# EAGLE design Metro THM+LDO Rev B (EAGLE 6.6.0)
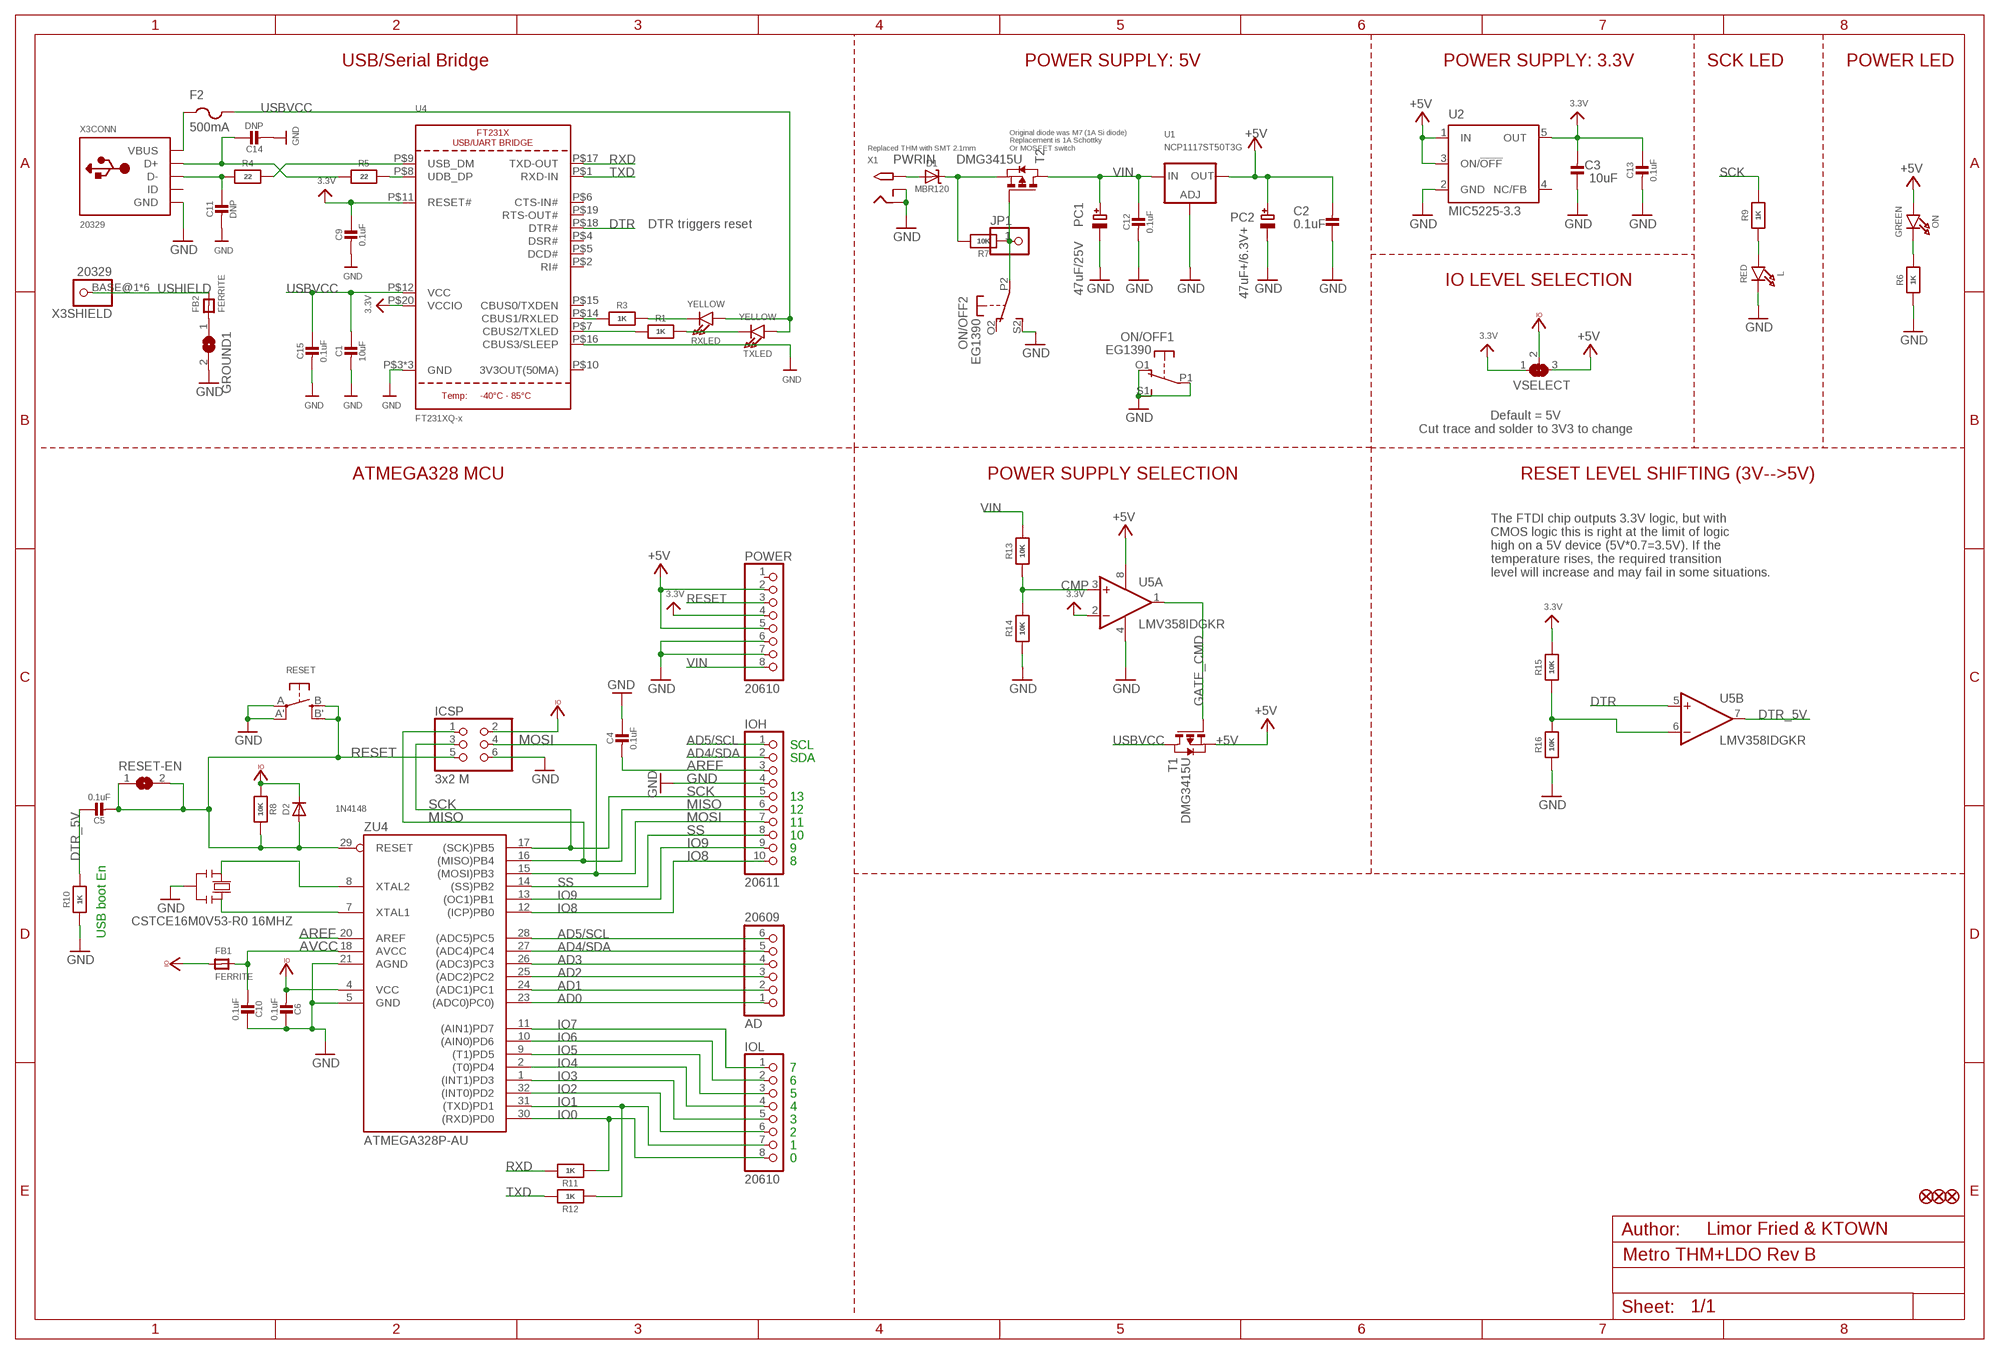
[diagram p0: schematic, sheet 1]

## Parts
AD  20609  HEADER-1X6  [1X06_OVAL]
C1  10uF  CAP_CERAMIC0805-NOOUTLINE  [0805-NO]
C2  0.1uF  CAP_CERAMIC0805-NOOUTLINE  [0805-NO]
C3  10uF  CAP_CERAMIC0805-NOOUTLINE  [0805-NO]
C4  0.1uF  CAP_CERAMIC0805-NOOUTLINE  [0805-NO]
C5  0.1uF  CAP_CERAMIC0805-NOOUTLINE  [0805-NO]
C6  0.1uF  CAP_CERAMIC0805-NOOUTLINE  [0805-NO]
C9  0.1uF  CAP_CERAMIC0805-NOOUTLINE  [0805-NO]
C10  0.1uF  CAP_CERAMIC0805_10MGAP  [0805_10MGAP]
C11  DNP  CAP_CERAMIC0805-NOOUTLINE  [0805-NO]
C12  0.1uF  CAP_CERAMIC0805-NOOUTLINE  [0805-NO]
C13  0.1uF  CAP_CERAMIC0805-NOOUTLINE  [0805-NO]
C14  DNP  CAP_CERAMIC0805-NOOUTLINE  [0805-NO]
C15  0.1uF  CAP_CERAMIC0805-NOOUTLINE  [0805-NO]
D1  MBR120  DIODE-SCHOTTKYSOD-123  [SOD-123]
D2  1N4148  DIODESOD-323  [SOD-323]
F2  500mA  PTCFUSE-1206  [R1206]
FB1  FERRITE  FERRITE-0805NO  [0805-NO]
FB2  FERRITE  FERRITE-0805NO  [0805-NO]
FD1  FIDUCIAL""  [FIDUCIAL_1MM]
FD2  FIDUCIAL""  [FIDUCIAL_1MM]
FD3  FIDUCIAL""  [FIDUCIAL_1MM]
GROUND1  SJ  [SJ]
ICSP  3x2 M  HEADER-2X3  [2X03_ROUND_70MIL]
IOH  20611  HEADER-1X10  [1X10_OVAL]
IOL  20610  HEADER-1X8  [1X08_OVAL]
JP1  HEADER-1X1ROUND  [1X01_ROUND]
L  RED  LED0805_NOOUTLINE  [CHIPLED_0805_NOOUTLINE]
ON  GREEN  LED0805_NOOUTLINE  [CHIPLED_0805_NOOUTLINE]
ON/OFF  EG1390  DPDT-EG1390  [EG1390]
PC1  47uF/25V  CAP_ELECTROLYTICPANASONIC_D  [PANASONIC_D]
PC2  47uF+/6.3V+  CAP_ELECTROLYTICPANASONIC_D  [PANASONIC_D]
POWER  20610  HEADER-1X8  [1X08_OVAL]
R1  1K  RESISTOR0805_NOOUTLINE  [0805-NO]
R3  1K  RESISTOR0805_NOOUTLINE  [0805-NO]
R4  22  RESISTOR0805_NOOUTLINE  [0805-NO]
R5  22  RESISTOR0805_NOOUTLINE  [0805-NO]
R6  1K  RESISTOR0805_NOOUTLINE  [0805-NO]
R7  10K  RESISTOR0805_NOOUTLINE  [0805-NO]
R8  10K  RESISTOR_0805MP  [_0805MP]
R9  1K  RESISTOR0805_NOOUTLINE  [0805-NO]
R10  1K  RESISTOR0805_NOOUTLINE  [0805-NO]
R11  1K  RESISTOR0805_NOOUTLINE  [0805-NO]
R12  1K  RESISTOR0805_NOOUTLINE  [0805-NO]
R13  10K  RESISTOR0805_NOOUTLINE  [0805-NO]
R14  10K  RESISTOR0805_NOOUTLINE  [0805-NO]
R15  10K  RESISTOR0805_NOOUTLINE  [0805-NO]
R16  10K  RESISTOR0805_NOOUTLINE  [0805-NO]
RESET  SWITCH_TACT_SMT  [EVQ-Q2]
RESET-EN  SJ  [SJ]
RXLED  YELLOW  LED0805_NOOUTLINE  [CHIPLED_0805_NOOUTLINE]
T1  DMG3415U  PMOSSOT23  [SOT-23]
T2  DMG3415U  PMOSSOT23  [SOT-23]
TXLED  YELLOW  LED0805_NOOUTLINE  [CHIPLED_0805_NOOUTLINE]
U1  NCP1117ST50T3G  LM1117SOT223-REFLOW  [SOT223-R]
U2  MIC5225-3.3  LP2985-XXDBVR33  [SOT23-DBV]
U4  FT231XQ-x  FT231X  [QFN20_4MM]
U5  LMV358IDGKR  LMV358MMX  [MSOP08]
VSELECT  SOLDERJUMPER_2WAY  [SOLDERJUMPER_2WAY_OPEN_NOPASTE]
X1  2.1MMJACKSMT  [DCJACK_2MM_SMT]
X3  20329  USB_W_SHIELD_20329  [4UCONN_20329]
Y2  CSTCE16M0V53-R0 16MHZ  RESONATORMU  [RESONATOR]
ZU4  ATMEGA328P-AU  [TQFP32-08]

## Nets
3.3V: C3.2 C9.1 C13.1 POWER.4 R15.2 U2.5(OUT) U4.P$11(RESET#) U4.P$20(VCCIO) U5.2(A:-IN) VSELECT.1
+5V [usbvcc]: C2.2 ON.A PC2.+ POWER.2 POWER.5 T1.2(S) U1.2(OUT) U1.4(OUT) U2.1(IN) U2.3(ON/!OFF) U5.8(P:V+) VSELECT.3
AD0: AD.1 ZU4.23((ADC0)PC0))
AD1: AD.2 ZU4.24((ADC1)PC1)
AD2: AD.3 ZU4.25((ADC2)PC2)
AD3: AD.4 ZU4.26((ADC3)PC3)
AD4/SDA: AD.5 IOH.2 ZU4.27((ADC4)PC4)
AD5/SCL: AD.6 IOH.1 ZU4.28((ADC5)PC5)
AREF [aref]: C4.2 IOH.3 ZU4.20(AREF)
AVCC: C10.2 FB1.2 ZU4.18(AVCC)
CMP: R13.1 R14.2 U5.3(A:+IN)
D+: C14.1 R5.1 X3.D+(CONN:D+)
D-: C11.1 R4.1 X3.D-(CONN:D-)
DTR: U4.P$18(DTR#) U5.5(B:+IN)
DTR_5V: C5.1 R10.2 U5.7(B:OUT)
GATE_CMD: T1.3(G) U5.1(A:OUT)
GND [gnd]: C1.2 C2.1 C3.1 C4.1 C6.1 C9.2 C10.1 C11.2 C12.2 C13.2 C14.2 C15.2 GROUND1.2 ICSP.6 IOH.4 L.C ON/OFF.O1(1:O) ON/OFF.P1(1:P) ON/OFF.S1(1:S) ON/OFF.S2(2:S) PC1.- PC2.- POWER.6 POWER.7 R6.1 R10.1 R14.1 R16.1 RESET.A'(P1) RESET.A(P) U1.1(ADJ) U2.2(GND) U4.P$3(GND) U4.P$13(GND) U4.P$16(CBUS3/SLEEP) U4.P$21(GND) U5.4(P:V-) X1.GND(RING) X1.GNDBREAK(RING_SW) X3.GND(CONN:GND) Y2.2 ZU4.5(GND) ZU4.21(AGND)
IO0: IOL.8 R11.1 ZU4.30((RXD)PD0)
IO1: IOL.7 R12.1 ZU4.31((TXD)PD1)
IO2: IOL.6 ZU4.32((INT0)PD2)
IO3: IOL.5 ZU4.1((INT1)PD3)
IO4: IOL.4 ZU4.2((T0)PD4)
IO5: IOL.3 ZU4.9((T1)PD5)
IO6: IOL.2 ZU4.10((AIN0)PD6)
IO7: IOL.1 ZU4.11((AIN1)PD7)
IO8: IOH.10 ZU4.12((ICP)PB0)
IO9: IOH.9 ZU4.13((OC1)PB1)
MISO: ICSP.1 IOH.6 ZU4.16((MISO)PB4)
MOSI: ICSP.4 IOH.7 ZU4.15((MOSI)PB3)
N$1: L.A R9.1
N$2: FB2.1 GROUND1.1
N$3: ON.C R6.2
N$4: R3.2 U4.P$14(CBUS1/RXLED)
N$5: R3.1 RXLED.C
N$6: R1.2 U4.P$7(CBUS2/TXLED)
N$7: R1.1 TXLED.C
N$9: R4.2 U4.P$9(USB_DM)
N$10: R5.2 U4.P$8(UDB_DP)
N$11: R15.1 R16.2 U5.6(B:-IN)
N$13: JP1.1 ON/OFF.P2(2:P) R7.1 T2.3(G)
N$15: D1.C R7.2 T2.2(S)
PWRIN [power]: D1.A X1.PWR2(TIP)
RESET: C5.2 D2.A ICSP.5 POWER.3 R8.1 RESET-EN.1 RESET-EN.2 RESET.B'(S1) RESET.B(S) ZU4.29(RESET)
RXD: R11.2 U4.P$17(TXD-OUT)
SCK: ICSP.3 IOH.5 R9.2 ZU4.17((SCK)PB5)
SS: IOH.8 ZU4.14((SS)PB2)
TXD: R12.2 U4.P$1(RXD-IN)
USBVCC [usbvcc]: C1.1 C15.1 F2.2 RXLED.A T1.1(D) TXLED.A U4.P$12(VCC)
USHIELD [gnd]: FB2.2 X3.BASE@1 X3.BASE@2 X3.SPRT@1 X3.SPRT@2 X3.SPRT@3 X3.SPRT@4
VBUS: F2.1 X3.VBUS(CONN:VBUS)
VCCIO [usbvcc]: C6.2 D2.C FB1.1 ICSP.2 R8.2 VSELECT.2 ZU4.4(VCC)
VIN [power]: C12.1 PC1.+ POWER.8 R13.2 T2.1(D) U1.3(IN)
XTAL1: Y2.3 ZU4.7(XTAL1)
XTAL2: Y2.1 ZU4.8(XTAL2)
Unconnected: ON/OFF.O2(2:O) POWER.1 U2.4(NC/FB) U4.P$2(RI#) U4.P$4(DSR#) U4.P$5(DCD#) U4.P$6(CTS-IN#) U4.P$15(CBUS0/TXDEN) U4.P$19(RTS-OUT#) X3.ID(CONN:ID)

## Notes on the sheet
- USB/Serial Bridge | POWER SUPPLY: 5V | POWER SUPPLY: 3.3V | SCK LED | POWER LED
- Replaced THM with SMT 2.1mm
- Original diode was M7 (1A Si diode)
  Replacement is 1A Schottky
  Or MOSFET switch
- DTR triggers reset
- IO LEVEL SELECTION
- Default = 5V
  Cut trace and solder to 3V3 to change
- ATMEGA328 MCU | POWER SUPPLY SELECTION | RESET LEVEL SHIFTING (3V-->5V)
- The FTDI chip outputs 3.3V logic, but with
   CMOS logic this is right at the limit of logic
   high on a 5V device (5V*0.7=3.5V). If the
   temperature rises, the required transition
   level will increase and may fail in some situations.
- SCL
- SDA
- 13
- 12
- 11
- 10
- 9
- 8
- USB boot En
- 7
- 6
- 5
- 4
- 3
- 2
- 1
- 0
- Limor Fried & KTOWN

## Power pins joined to a net without a drawn wire
3V3OUT(50MA): U4.P$10(3V3OUT(50MA))

## Library data of the parts
AD = microbuilder:HEADER-1X6: PIN HEADER
C1-C6 C9-C15 = microbuilder:CAP_CERAMIC: Ceramic Capacitors For new designs, use the packages preceded by an '_' character since they are more reliable: The following footprints should be used on most boards: _0402 - Standard footprint for regular board layouts _0603 - Standard footprint for regular board layouts _0805 - Standard footprint for regular board layouts _1206 - Standard footprint for regular board layouts For extremely tight-pitch boards where space is at a premium, the following 'micro-pitch' footprints can be used (smaller pads, no silkscreen outline, etc.): _0402MP - Micro-pitch footprint for very dense/compact boards _0603MP - Micro-pitch footprint for very dense/compact boards _0805MP - Micro-pitch footprint for very dense/compact boards _1206MP - Micro-pitch footprint for very dense/compact boards
D1 = microbuilder:DIODE-SCHOTTKY
D2 = microbuilder:DIODE: Diode SMA Model Volts Amps Type Vf Ir Digikey # Notes SSA34-E3 40V 3A Schottky 480mV @ 3A 200uA @ 40V SSA34-E3/61TGITR-ND CDBA120-G 20V 1A Schottky 500mV @ 1A 500uA @ 20V 641-1014-6-ND REEL MBRA210 10V 2A Schottky 350mV @ 2A 700uA @ 10V MBRA210LT3 SOD-123 Model Volts Amps Type Vf Ir Order # Notes BAT54T1G 30V 200mA Schottky 800mV @ 200mA 2uA @ 25V BAT54T1GOSTR-ND B0530W 30V 500mA Schottky 430mV @ 500mA 130uA @ 30V B0530W-FDICT-ND REEL MBR120 20V 1A Schottky 340mV @ 1A MBR120VLSFT1GOSCT-ND SOD-323 Model Volts Amps Type Vf Ir Order # Notes PMEG2005EJ 20V 500mA Schottky 355mV @ 500mA 568-4110-1-ND ZLLS410 10V 570mA Schottky 380mV @ 570mA ZLLS410CT-ND 1N4148WS 75V 150mA Silicon/Simple 1V 1N4148WSFSCT-ND REEL SOD-523 Model Volts Amps Type Vf Ir Order # Notes BAT54XV2 30V 200mA Schottky 0.8V @ 100mA BAT54XV2CT-ND TB751S 30V 30mA Schottky RB751S-40TE61CT-ND SOT23-R/W (R = Solder Paste/Reflow Ovens, W = Hand-Soldering) Model Volts Amps Type Vf Ir Order # Notes BAT54FILM 40V 300mA Schottky 497-7162-1-ND POWERDI-5 Model Volts Amps Type Vf Ir Order # Notes PDS560 60V 5A Schottky 670mV @ 5A 150uA @ 60V PDS560DICT-ND
F2 = adafruit:PTCFUSE: PTC fuses, resettable thermistors
FB1 FB2 = microbuilder:FERRITE: Ferrite Bead 0603 MMZ1608B121C - 120 Ohm @ 100MHz, 600mA, 0.15 Ohm DC Resistance - Digikey: 445-2164-1-ND BK1608HW121-T - 120 Ohm, 600mA Ferrite Chip - Digikey: 587-1876-2-ND 0805 HZ0805B272R-10 - 2.7K Ohm @ 100MHz, 200mA, 0.8 Ohm DC Resistance - Digikey: 240-2504-1-ND (see also Murata BLM21BD272SN1L) MMZ2012Y152B - 1.5K Ohm @ 100MHz, 500mA, 0.4 Ohm DC Resistance - Digikey: 445-1560-1-ND - Mainly for high frequency (80-400MHz) MMZ2012R102A - 1K Ohm @ 100MHz, 500mA, 0.3 Ohm DC Resistance - Digikey: 445-1555-2-ND - More general purpose (10-200MHz)
FD1-FD3 = microbuilder:FIDUCIAL: Fiducial Alignment Points Various fiducial points for machine vision alignment.; BOM: EXCLUDE
GROUND1 RESET-EN = jumper:SJ: SMD solder JUMPER
ICSP = microbuilder:HEADER-2X3: PIN HEADER
IOH = microbuilder:HEADER-1X10: PIN HEADER
IOL POWER = microbuilder:HEADER-1X8: PIN HEADER
JP1 = microbuilder:HEADER-1X1: PIN HEADER
L ON RXLED TXLED = microbuilder:LED: LED 0603 - 0603 Surface Mount Package 2mA: Green LED - Low Power (3.9mcd, 2ma, 1.7Vf) - Digikey: 475-2709-2-ND Orange LED - Low Power (9.8mcd, 2ma, 1.8Vf) - Digikey: 475-1194-2-ND Red LED - Low Power (5mcd, 2ma, 1.8Vf) - Digikey: 475-1195-2-ND Yellow LED - Low Power (7mcd, 2ma, 1.8Vf) - Digikey: 475-1196-2-ND 5mA: Blue LED - Low Power (17mcd, 5ma, 2.9Vf) - Digikey: LNJ937W8CRACT-ND 0805 - 0805 Surface Mount Package 2mA: Red LED (8.8mcd, 2mA, 1.8Vf, Clear) - Low Power [Digikey: 475-2510-1-ND] Green LED (5mcd, 2mA, 1.8Vf, Clear) - Low Power [Digikey: 475-2730-1-ND] Yellow LED (11.3mcd, 2mA, 1.8Vf, Clear) - Low Power [Digikey: 475-2555-1-ND] 20mA: Red LED (104mcd, 20mA, Diffused) - LS R976 [Digikey: 475-1278-6-ND] Red LED (12mcd, 20mA, 2.0Vf, Clear) - APT2012EC [Digikey: 754-1128-1-ND] Green LED (15mcd, 20mA, 2.2Vf, Clear) - APT2012GC [Digikey: 754-1131-1-ND] Orange LED (160mcd, 20mA, 2.1Vf, Clear) - APT2012SECK [Digikey: 754-1130-1-ND] 1206 - 1206 Surface Mount Package Green LED (26mcd, 20mA, Diffused) - LG N971 [Digikey: 475-1407-6-ND] Red LED (15mcd, 20mA, Diffused) - LH N974 [Digikey: 475-1416-6-ND] Cree - Cree High-Power Surface Mount LEDs XPEBWT-L1-0000-00D50 - White 111lm 350mA 2.9Vf 6200K 110° XTEAWT-00-0000-00000LEE3 - White 114lm 350mA 2.85Vf 5000K 115° Everlight - Everlight 45-21 Series Surface Mount LEDs 45-21/QK2C-B2832AC2CB2/2T - Warm White 2000mcd 20mA 3.25Vf 3050K 120° 45-21/LK2C-B38452C4CB2/2T - Nuetral White 2000mcd 20mA 3.25Vf 4150K 120° 45-21/LK2C-B50634C6CB2/2T - Cold White 2200mcd 20mA 3.25Vf 5650K 120° PLCC2 Reverse Mount LS T77K-J1L2-1-0-2-R18-Z - Red 11.25mcd 2mA 1.8Vf 630nm 120° LO T77K-L1M2-24-Z - Orange 19.6mcd 2mA 1.8Vf 606nm 120° LY T77K-K2M1-26-Z - Yellow 15.7mcd 2mA 1.8Vf 587nm 120°
ON/OFF = adafruit:DPDT
PC1 PC2 = microbuilder:CAP_ELECTROLYTIC: Electrolytic Capacitors SMT PANASONIC_C - Size C Panasonic Electrolytic Aluminum Capacitor 47µF 16V 20% Electrolytic Capacitor [Digikey: PCE3890TR-ND] PANASONIC_D - Size D Panasonic Electrolytic Aluminum Capacitor 100µF 25V 20% Electrolytic Capacitor [Digikey: PCE3898TR-ND] PTH 3.5 mm grid, 8 mm diameter ... 3.5 mm grid, 10 mm diameter ...
R1 R3-R16 = microbuilder:RESISTOR: Resistors For new designs, use the packages preceded by an '_' character since they are more reliable: The following footprints should be used on most boards: _0402 - Standard footprint for regular board layouts _0603 - Standard footprint for regular board layouts _0805 - Standard footprint for regular board layouts _1206 - Standard footprint for regular board layouts For extremely tight-pitch boards where space is at a premium, the following 'micro-pitch' footprints can be used (smaller pads, no silkscreen outline, etc.): _0402MP - Micro-pitch footprint for very dense/compact boards _0603MP - Micro-pitch footprint for very dense/compact boards _0805MP - Micro-pitch footprint for very dense/compact boards _1206MP - Micro-pitch footprint for very dense/compact boards
RESET = microbuilder:SWITCH_TACT_SMT: SMT Tact Switches 6x6mm - Digikey: P12940SCT-ND KMR2 (4.6x2.8mm) - Digikey: 401-1426-1-ND EVQ-PQHB55 - Light Touch, 160GF (4.5x4.5mm) - Digikey: P8090SCT-ND KMT0 - KMT021 NGJ LHS (etc.) IP68/Waterproof - Digikey: CKN10289CT-ND
T1 T2 = zetex:PMOSSOT23: MOS FET; OC_FARNELL: unknown; OC_NEWARK: unknown
U1 = microbuilder:LM1117: LM1117 Voltage Regulator LM1117 Adjustable Voltage regulator [Digikey: LM1117IMP-ADJDKR-ND] LM1117 3.3V Voltage regulator [AP1117E33GDIDKR-ND] LM1117 5.0V Voltage regulator [AP1117E50GDIDKR-ND] SOT223-REFLOW - SOT223 package for solder paste/reflow ovens SOT223-WAVE - SOT223 package for hand-soldering (larger pads) Note: For the fixed-voltage regulators, simply set the ADJ pin to GND.
U2 = SmartPrj:LP2985-XXDBVR: ULTRALOW-POWER 50-mA LOW-DROPOUT LINEAR REGULATORS 50-mA Low-Dropout Regulator Source: http://focus.ti.com/lit/ds/symlink/tps77001.pdf
U4 = microbuilder:FT231X: FT231X USB To Full Handshake UART IC
U5 = linear:LMV358?*: Dual General Purpose, Low Voltage, Rail-to-Rail Output Operational Amplifiers Source: http://www.national.com/mpf/LM/LMV321.html http://www.national.com/dt/lmv_qual.pdf
VSELECT = microbuilder:SOLDERJUMPER_2WAY: 2-Way Solder Jumper
X1 = adafruit:2.1MMJACK: 2.1mm x 5.5mm THM DC jack with internal switch. Digikey part #PJ-102A, 4UCON part #05537 2.1mm x 5.5mm SMT DC jack with internal switch. Digikey part #PJ-002A-SMT, 4UCON part #03267 By microbuilder.eu & adafruit.com
X3 = microbuilder:USB_W_SHIELD
Y2 = SmartPrj:RESONATOR
ZU4 = SmartPrj:ATMEGA328P-: MICROCONTROLLER 4 Kbytes FLASH 128 bytes SRAM 256 bytes EEPROM UART 6-channel 10 bit ADC

## Net classes
1 power: width 0.305 mm, drill 0.483 mm, clearance 0.203 mm
2 gnd: width 0.305 mm, drill 0.483 mm, clearance 0.203 mm
3 usbvcc: width 0.305 mm, drill 0.483 mm, clearance 0.203 mm
4 aref: width 0.254 mm, drill 0.483 mm, clearance 0.203 mm

## Board
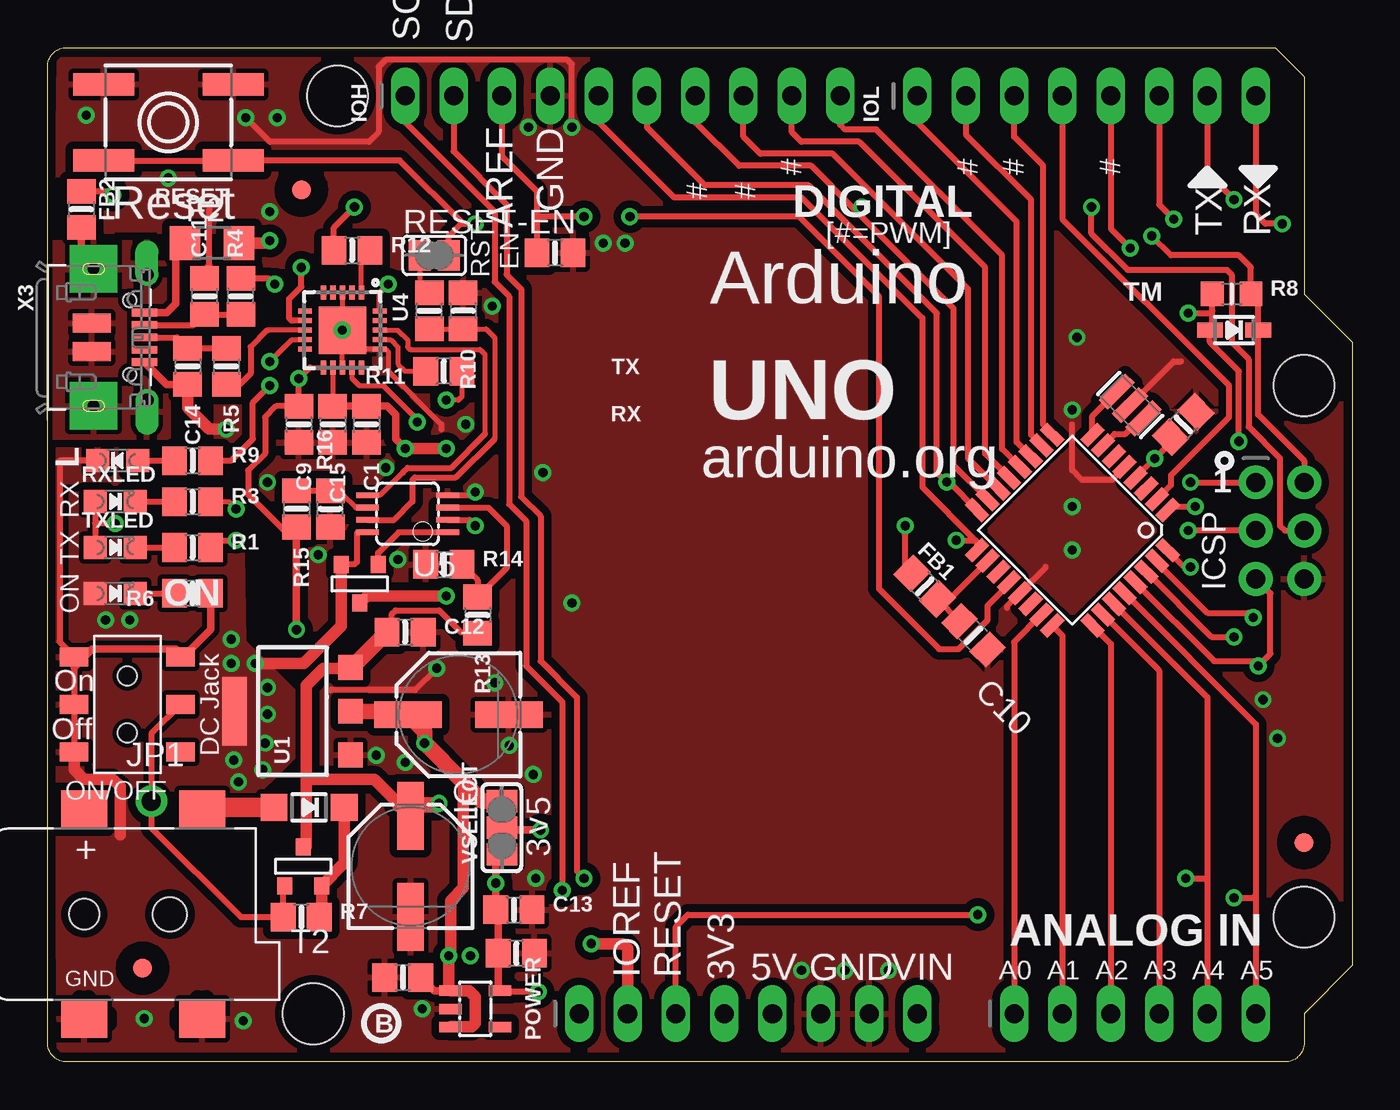
[diagram p1: board, top side]
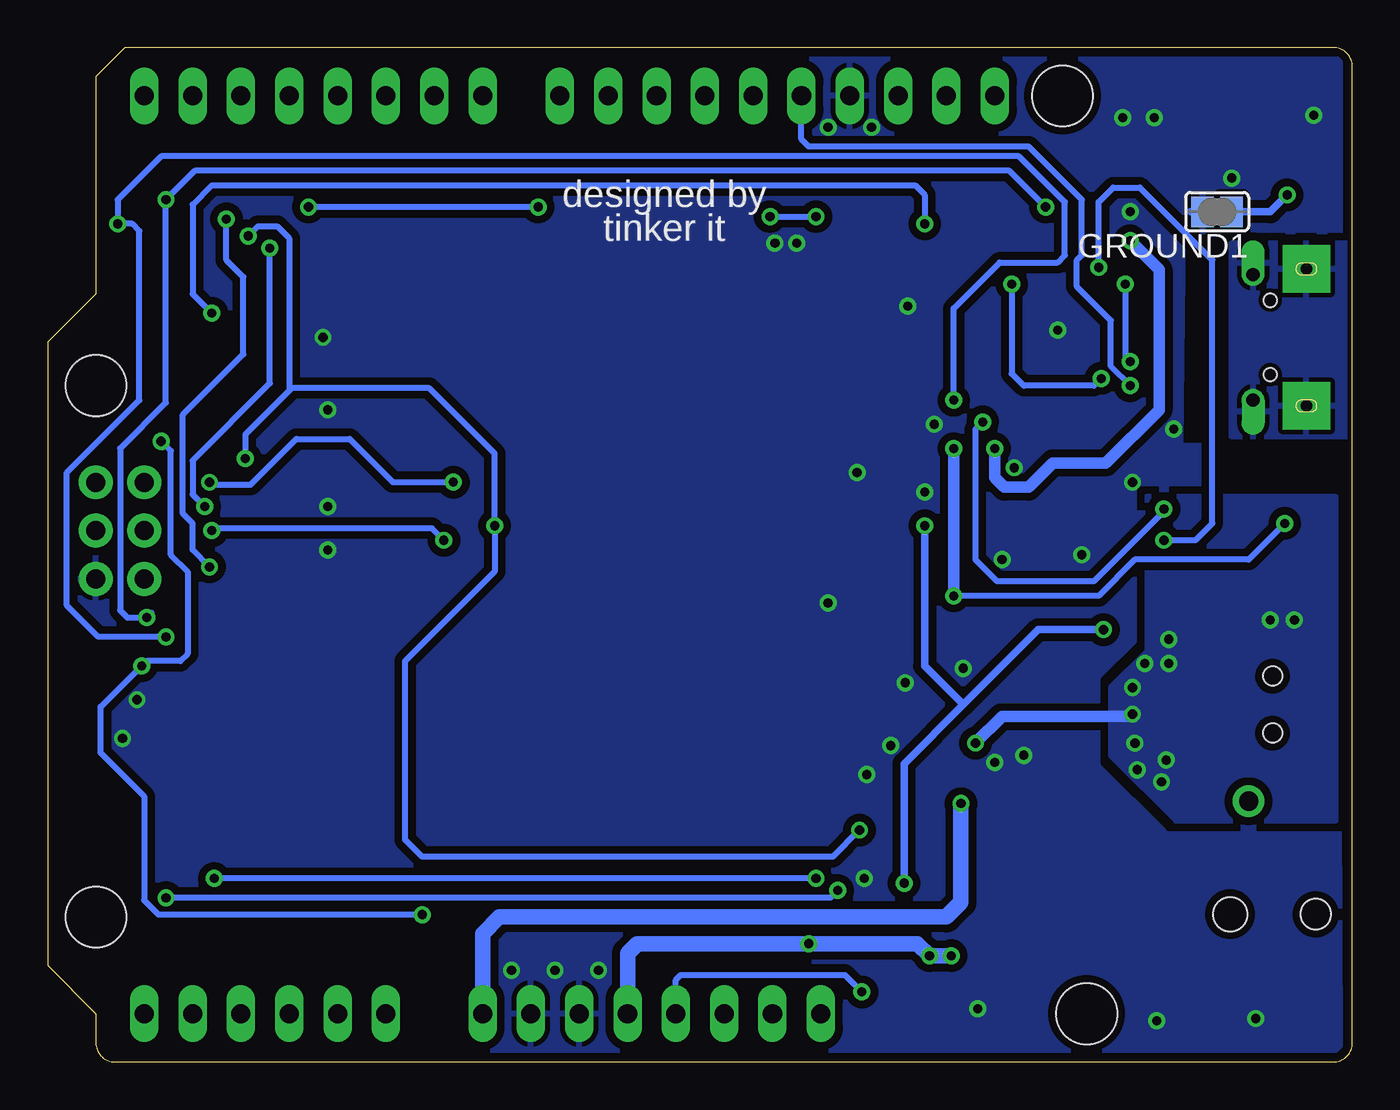
[diagram p2: board, bottom side, seen from below]

Size 68.58 x 53.34 mm. Coordinates in mm from the lower left corner, seen from the top.
Outline: 64.52,53.34 66.04,51.82 66.04,40.39 68.58,37.85 68.58,5.08 66.04,2.54 66.04,1 arc-90 65.04,0 1,0 arc-90 0,1 0,52.34 arc-90 1,53.34 64.52,53.34
Copper layers (1*16): Top 0.035mm / dielectric 1.5mm / Bottom 0.035mm
Design rules "adafruit *": minimum track width 8mil, minimum drill 15.5mil, track to track 10mil, track to pad 10mil, pad to pad 10mil, via to via 10mil, smd to smd 8mil, copper to edge 10mil, drill to drill 8mil, minimum pad ring 10mil, minimum via ring 8mil, stop-mask expansion 2mil, vias tented up to drill 20mil, thermal gap 10mil
Holes 3.2 mm at 66.04,35.56 66.04,7.62 15.24,50.8 13.97,2.54

### Footprints (pad centres in the part's own frame; a part is rotated, then mirrored left to right if it is on the bottom)
1X06_OVAL = drill 1 long: 1 -6.35,0; 2 -3.81,0; 3 -1.27,0; 4 1.27,0; 5 3.81,0; 6 6.35,0
0805-NO = smd 1.3 x 1.5: 1 -0.95,0; 2 0.95,0
0805_10MGAP = smd 1.2 x 1.5: 1 -1.05,0; 2 1.05,0
SOD-123 = smd 1.4 x 1.4: A 1.85,0; C -1.85,0
SOD-323 = smd 1.35 x 0.8: A 1.27,0; C -1.27,0
R1206 = smd 1.6 x 1.803: 1 -1.422,0; 2 1.422,0
FIDUCIAL_1MM = smd 1 x 1: 1 0,0
SJ = smd 1.168 x 1.6: 1 -0.762,0; 2 0.762,0
2X03_ROUND_70MIL = drill 1 pad 1.778: 1 -2.54,-1.27; 2 -2.54,1.27; 3 0,-1.27; 4 0,1.27; 5 2.54,-1.27; 6 2.54,1.27
1X10_OVAL = drill 1 long: 1 -11.43,0; 2 -8.89,0; 3 -6.35,0; 4 -3.81,0; 5 -1.27,0; 6 1.27,0; 7 3.81,0; 8 6.35,0; 9 8.89,0; 10 11.43,0
1X08_OVAL = drill 1 long: 1 -8.89,0; 2 -6.35,0; 3 -3.81,0; 4 -1.27,0; 5 1.27,0; 6 3.81,0; 7 6.35,0; 8 8.89,0
1X01_ROUND = drill 1 pad 1.676: 1 0,0
CHIPLED_0805_NOOUTLINE = smd 1.2 x 1.2: A 0,-1.05; C 0,1.05
EG1390 = smd 1 x 1.5: O1 -2.5,2.8; O2 -2.5,-2.8; P1 0,2.8; P2 0,-2.8; S1 2.5,2.8; S2 2.5,-2.8 | hole 1: 1.5,0; -1.5,0
PANASONIC_D = smd 3.556 x 1.4: + 2.654,0; - -2.654,0
_0805MP = smd 1.2 x 1.3: 1 -1.016,0; 2 1.016,0
EVQ-Q2 = smd 3.2 x 1.2: A -3.4,-2; A' 3.4,-2; B -3.4,2; B' 3.4,2
SOT-23 = smd 0.787 x 0.889: 1 0.025,-1.016; 2 -0.94,1.016; 3 0.991,1.016
SOT223-R = smd 1.3 x 1.3: 1 -2.3,-3.05; 2 0,-3.05; 3 2.3,-3.05 | smd 3.6 x 1.3: 4 0,3.05
SOT23-DBV = smd 0.55 x 1.2: 1 -0.95,-1.3; 2 0,-1.3; 3 0.95,-1.3; 4 0.95,1.3; 5 -0.95,1.3
QFN20_4MM = smd 0.73 x 0.28: P$1 -1.965,1; P$2 -1.965,0.5; P$3 -1.965,0; P$4 -1.965,-0.5; P$5 -1.965,-1; P$11 1.965,-1; P$12 1.965,-0.5; P$13 1.965,0; P$14 1.965,0.5; P$15 1.965,1 | smd 0.28 x 0.73: P$6 -1,-1.965; P$7 -0.5,-1.965; P$8 0,-1.965; P$9 0.5,-1.965; P$10 1,-1.965; P$16 1,1.965; P$17 0.5,1.965; P$18 0,1.965; P$19 -0.5,1.965; P$20 -1,1.965 | smd 2.5 x 2.5: P$21 0,0
MSOP08 = smd 0.3 x 1.2: 1 -0.976,-2.113; 2 -0.326,-2.113; 3 0.324,-2.113; 4 0.974,-2.113; 5 0.974,2.112; 6 0.324,2.112; 7 -0.326,2.112; 8 -0.976,2.112
SOLDERJUMPER_2WAY_OPEN_NOPASTE = smd 1.168 x 1.6: 1 -1.397,0; 2 0,0; 3 1.397,0
DCJACK_2MM_SMT = smd 2.4 x 2: GND 0,-5.5; GNDBREAK 6.2,-5.5; PWR1 0,5.5; PWR2 6.2,5.5 | hole 1.6: 0,0 | hole 1.8: 4.5,0
4UCONN_20329 = smd 1 x 2: BASE@1 -0.75,-2; BASE@2 0.75,-2 | smd 0.4 x 1.35: D+ 0,0.775; D- -0.65,0.775; GND 1.3,0.775; ID 0.65,0.775; VBUS -1.3,0.775 | drill 0.7 offset: SPRT@1 -3.3,0.9; SPRT@2 3.3,0.9 | drill 0.6 pad 2.5 square: SPRT@3 -3.6,-1.9; SPRT@4 3.6,-1.9 | hole 0.7: -1.95,0; 1.95,0
RESONATOR = smd 0.7 x 2: 1 -1,0; 2 0,0; 3 1,0
TQFP32-08 = smd 1.27 x 0.559: 1 -4.293,2.8; 2 -4.293,2; 3 -4.293,1.2; 4 -4.293,0.4; 5 -4.293,-0.4; 6 -4.293,-1.2; 7 -4.293,-2; 8 -4.293,-2.8; 17 4.293,-2.8; 18 4.293,-2; 19 4.293,-1.2; 20 4.293,-0.4; 21 4.293,0.4; 22 4.293,1.2; 23 4.293,2; 24 4.293,2.8 | smd 0.559 x 1.27: 9 -2.8,-4.293; 10 -2,-4.293; 11 -1.2,-4.293; 12 -0.4,-4.293; 13 0.4,-4.293; 14 1.2,-4.293; 15 2,-4.293; 16 2.8,-4.293; 25 2.8,4.293; 26 2,4.293; 27 1.2,4.293; 28 0.4,4.293; 29 -0.4,4.293; 30 -1.2,4.293; 31 -2,4.293; 32 -2.8,4.293

### Placement (x,y rotation side)
AD  57.15,2.54 0 top
C1  16.76,33.53 270 top
C2  18.67,4.45 0 top
C3  24.64,5.71 180 top
C4  26.67,42.55 180 top
C5  20.07,39.5 90 top
C6  59.69,33.53 225 top
C9  13.21,33.53 270 top
C10  48.66,22.44 135 top
C11  8.26,40.26 90 top
C12  18.8,22.61 0 top
C13  24.51,8 0 top
C14  7.37,36.58 270 top
C15  14.99,33.53 270 top
D1  13.74,13.39 180 top
D2  62.36,38.48 180 top
F2  8.64,43.05 0 top
FB1  46.1,25.02 315 top
FB2  1.78,44.83 270 top
FD1  13.34,45.85 0 top
FD2  66.03,11.53 0 top
FD3  5,4.93 0 top
GROUND1  7.11,44.7 180 bottom
ICSP  64.77,27.94 270 top
IOH  30.23,50.8 0 top
IOL  54.61,50.8 0 top
JP1  5.46,13.72 0 top
L  3.68,31.62 90 top
ON  3.56,24.64 270 top
ON/OFF  4.19,18.8 90 top
PC1  19.08,10.29 90 top
PC2  21.59,18.26 180 top
POWER  36.83,2.54 0 top
R1  7.62,27.05 0 top
R3  7.62,29.46 0 top
R4  10.16,40.26 90 top
R5  9.4,36.58 270 top
R6  7.62,24.64 180 top
R7  13.34,7.62 0 top
R8  62.23,40.39 0 top
R9  7.62,31.62 0 top
R10  21.84,39.5 270 top
R11  20.83,36.32 180 top
R12  16,42.67 0 top
R13  22.61,23.5 270 top
R14  20.83,26.16 0 top
R15  13.08,29.08 270 top
R16  14.86,29.08 90 top
RESET  6.35,49.4 180 top
RESET-EN  20.32,42.42 0 top
RXLED  3.56,29.46 270 top
T1  16.38,25.15 0 top
T2  13.46,10.29 180 top
TXLED  3.56,27.05 270 top
U1  12.88,18.44 90 top
U2  22.48,2.79 270 top
U4  15.49,38.48 270 top
U5  18.92,28.83 90 top
U$11  [METROSILK_TOP]  0,0 0 top
U$14  [METROSILK_BOT]  0,0 0 top
U$15  [PCBFEAT-REV-040]  17.53,2.03 0 top
VSELECT  23.88,12.32 90 top
X1  1.93,7.77 0 top
X3  4.32,38.1 270 top
Y2  56.9,34.54 315 top
ZU4  53.86,27.97 225 top

### Tracks (layer width: path | path; a pad name or v marks a point on that pad's centre or on a via)
3.3V  (via drill 0.48)
  Top 0.254: 13.78,36.52 U4.P$11
  Top 0.305: 13.78,36.52 v13.21,35.94 C9.1 12,34.48 11.43,33.91 11.43,32 10.54,31.11 10.54,29.84 12.45,27.94 13.02,27.94 13.02,28.07 R15.2 | U4.P$20 17.46,40.45 v17.91,40.89 | v25.78,3.68 23.84,3.68 U2.5 | U5.2 22.17,28.5 v22.48,28.19
  Top 0.406: U2.5 23.69,3.83 C3.2 23.69,7.87 C13.1 v23.56,9.4 23.56,10.61 VSELECT.1 | R15.2 v13.08,22.73
  Bottom 0.305: v17.91,40.89 17.91,36.2 17.27,35.56 13.59,35.56 v13.21,35.94 | POWER.4 35.56,4.32 35.31,4.57 26.67,4.57 v25.78,3.68
  Bottom 0.406: v23.56,9.4 23.56,15.68 20.45,18.8 | 20.45,18.8 16.51,22.73 v13.08,22.73 | v22.48,28.19 22.48,20.83 20.45,18.8
+5V  (via drill 0.48)
  Top 0.305: U5.8 16.3,27.85 16.26,27.81 16.26,26.29 16.13,26.16 T1.2
  Top 0.406: C2.2 20.32,3.74 U2.1
  Top 0.61: 21.84,14.69 21.84,9.14 21.18,8.48 21.18,5.68 v21.08,5.59 21.08,3.84 U2.1 22.16,3.74 22.48,3.43 22.48,2.03 22.29,1.84 U2.3 | POWER.2 30.48,5.97 30.23,6.22 v28.57,6.22 | T1.2 15.44,22.94 13.46,20.95 v10.92,20.95
  Top 0.813: VSELECT.3 22.82,13.72 21.84,14.69 21.84,14.73 v19.81,16.76 19.81,17.39 PC2.+ 18.76,18.44 U1.2
  Bottom 0.61: v19.81,16.76 18.41,18.16 11.81,18.16 11.68,18.29 v11.56,18.29
  Bottom 0.813: POWER.5 38.1,5.71 37.59,6.22 v28.57,6.22 22.86,6.22 v22.23,5.59 v21.08,5.59
  other vias: 3.05,23.24 4.32,23.24 9.65,20.95 11.56,19.68 11.43,16.76 9.78,15.88 11.3,15.37 10.03,14.73 9.65,22.23
  pour Bottom (isolate 0.406, no thermals): 0.89,29.72 10.79,29.72 10.79,21.59 12.7,19.68 12.7,16.13 9.27,12.7 0.89,12.7
  pour Top (no thermals): 1.27,12.7 1.27,29.84 10.16,29.84 10.29,22.1 12.95,19.43 12.95,16.13 10.16,13.34 10.16,12.7
AD0
  Top 0.305: ZU4.23 50.8,22.08 AD.1
AD1
  Top 0.305: ZU4.24 53.34,22.42 AD.2
AD2
  Top 0.305: ZU4.25 55.88,21.99 AD.3
AD3
  Top 0.305: ZU4.26 58.42,20.58 AD.4
AD4/SDA  (via drill 0.48)
  Top 0.305: IOH.2 21.34,47.88 24.13,45.09 24.13,41.4 24.89,40.64 24.89,29.72 25.91,28.7 25.91,21.08 27.81,19.18 27.81,10.03 v28.19,9.65 | ZU4.27 60.96,19.17 60.96,9.53 | 60.96,9.53 AD.5 | v59.82,9.65 60.83,9.65 60.96,9.53
  Bottom 0.305: v28.19,9.65 v59.82,9.65
AD5/SCL  (via drill 0.48)
  Top 0.305: ZU4.28 63.5,17.76 63.5,8.76 | IOH.1 18.8,49.4 23.5,44.7 23.5,41.02 24.26,40.26 24.26,29.34 25.15,28.45 25.15,20.83 27.05,18.92 v27.05,9.02 | 63.5,8.76 AD.6 | v62.36,8.64 63.37,8.64 63.5,8.76
  Bottom 0.305: v27.05,9.02 27.43,8.64 v62.36,8.64
AREF  (via drill 0.48)
  Top 0.305: v30.61,44.45 39.5,44.45 43.69,40.26 43.69,24.89 46.86,21.72 47.88,21.72 49.4,23.24 49.4,24 50.54,25.14 ZU4.20 | 25.72,44.45 25.72,45.78 23.88,47.62 IOH.3 | 25.72,44.45 C4.2 | v28.19,44.45 25.72,44.45
  Bottom 0.305: v30.61,44.45 v28.19,44.45
AVCC
  Top 0.305: ZU4.18 47.41,24.35 FB1.2 47.92,23.2 C10.2
CMP
  Top 0.305: U5.3 23.17,29.15 24.13,28.19 24.13,25.97 R13.1 22.61,25.33 R14.2
D+
  Top 0.305: X3.D+ 6.79,38.1 C14.1 R5.1
D-
  Top 0.305: X3.D- 7.7,38.75 C11.1 R4.1
DTR
  Top 0.254: U4.P$18 18.41,38.48 18.92,37.97 18.92,37.59 19.05,37.47 22.73,37.47 22.99,37.21 22.99,33.02 | 18.67,30.99 17.48,29.8 U5.5
  Top 0.305: 18.67,30.99 18.92,31.24 21.21,31.24 22.99,33.02
DTR_5V
  Top 0.254: 23.5,32.77 23.5,38.1 23.05,38.55 R10.2 C5.1
  Top 0.305: U5.7 18.22,28.5 19.18,29.46 19.18,30.61 19.3,30.73 21.46,30.73 23.5,32.77
GATE_CMD
  Top 0.305: U5.1 18.45,27.85 17.37,26.77 T1.3
GND  (via drill 0.48)
  Top 0.254: U4.P$3 U4.P$21 15.88,38.1 | 20.7,33.53 17.91,36.32 17.91,37.34 17.76,37.48 U4.P$16 16.49,37.48 15.88,38.1 | U4.P$13 15.49,37.72 15.88,38.1
  Top 0.305: Y2.2 59.18,36.83 59.56,36.83 | ZU4.5 55.93,30.61 54.36,30.61 53.85,31.11 53.85,33.53 | L.C 0.64,31.62 0.64,22.1 1.44,21.3 ON/OFF.S1 1.39,20.76 ON/OFF.P1 ON/OFF.O1 | C11.2 8.26,41.66 8.51,41.91 8.51,44.83 | 52.45,26.04 52.45,26 ZU4.21 50.42,23.96 50.42,23.88 | 20.7,33.53 20.7,33.27 | v27.56,49.15 27.56,52.45 27.3,52.7 17.78,52.7 17.4,52.32 17.4,48.9 16.89,48.39 11.68,48.39 v10.41,49.66 | U5.4 22.31,29.8 v22.48,29.97 | v20.45,20.7 19.3,19.56 14.86,19.56
  Top 0.406: X3.GND 6.27,35.63 C14.2 | R6.1 8.57,22.75 7.12,21.3 ON/OFF.S2 7.08,21.3 7.12,21.33 6.73,21.72 2.35,21.72 1.39,20.76
  Top 0.61: C14.2 7.37,34.42 8.51,33.27 v9.4,33.27 | ON/OFF.O1 1.39,15.37 1.91,14.86 3.43,14.86 3.81,14.48 3.81,11.94
  Bottom 0.406: GROUND1.2 8.51,44.7
  other vias: 17.78,31.24 19.68,2.79 5.08,2.29 10.29,2.16 2.03,49.78 15.49,38.48 23.5,19.94 17.27,16.13 26.04,30.99 63.88,19.05 54.1,38.1 53.85,34.29 53.85,29.21 53.85,26.92 25.65,9.65 24.26,16.64 11.68,44.7 6.35,46.48 25.27,49.15 64.64,17.02 11.56,30.48 29.21,43.05 30.35,43.05 41.91,4.83 39.62,4.83 44.2,4.83 12.06,49.66 21.97,33.53 25.53,15.11 14.22,26.67 18.41,26.42 27.56,24.13 23.37,39.75 18.8,15.75
  pour Bottom (isolate 0.406, rank 2): 0.64,52.7 67.69,52.7 67.94,52.45 67.94,0.64 0.89,0.64 0.64,0.89 0.76,32.38 9.02,32.38 8.89,43.69 0.64,43.69
  pour Top (isolate 0.406, rank 2): 0.64,52.7 67.94,52.7 67.94,0.64 0.64,0.64 0.38,32.38 8.89,32.38 8.89,43.69 0.51,43.69
IO0  (via drill 0.48)
  Top 0.254: R11.1 21.78,34.99 21.59,34.8 v20.95,34.8
  Top 0.305: ZU4.30 61.17,22.35 v62.36,22.35 | IOL.8 63.5,44.58 64.01,44.07 v64.9,44.07
  Bottom 0.305: v62.36,22.35 65.91,22.35 67.56,24 67.56,30.99 63.75,34.8 63.75,43.69 64.14,44.07 v64.9,44.07 64.9,45.34 62.61,47.62 17.53,47.62 15.11,45.21 15.11,42.42 15.49,42.04 18.54,42.04 20.95,39.62 v20.95,34.8
IO1  (via drill 0.48)
  Top 0.305: ZU4.31 58.31,26.27 60.96,23.62 63.12,23.62 v63.37,23.37 | R12.1 15.05,43.88 v16.13,44.96 | IOL.7 60.96,46.74 v62.36,45.34
  Bottom 0.305: v16.13,44.96 18.03,46.86 60.83,46.86 v62.36,45.34 62.36,34.67 64.77,32.26 64.77,23.75 64.39,23.37 v63.37,23.37 63.12,23.62
IO2  (via drill 0.48)
  Top 0.305: 59.77,26.04 v60.07,26.04 59.75,26.04 ZU4.32 | v59.18,44.32 58.42,45.09 IOL.6
  Bottom 0.305: v60.07,26.04 60.96,26.92 60.96,28.32 61.47,28.83 61.47,34.04 58.29,37.21 58.29,41.27 59.18,42.16 v59.18,44.32
IO3  (via drill 0.48)
  Top 0.305: ZU4.1 59.06,29.21 v60.33,29.21 | v56.9,42.8 55.88,43.81 IOL.5
  Bottom 0.305: v56.9,42.8 56.9,35.69 60.96,31.62 60.96,29.84 v60.33,29.21
IO4
  Top 0.305: ZU4.2 59.05,30.34 59.05,30.86 62.1,33.91 62.1,35.56 53.34,44.32 IOL.4
IO5
  Top 0.305: ZU4.9 52.8,33.05 52.32,33.53 52.32,47.12 50.8,48.64 IOL.3
IO6
  Top 0.305: ZU4.10 51.69,32.97 51.69,45.34 48.26,48.77 IOL.2
IO7
  Top 0.305: ZU4.11 50.93,32.6 50.93,44.2 45.72,49.4 IOL.1
IO8
  Top 0.305: ZU4.12 50.16,32.23 50.16,42.42 43.56,49.02 41.91,49.02 41.66,49.28 IOH.10
IO9
  Top 0.305: ZU4.13 49.28,31.98 49.28,41.78 42.67,48.39 39.62,48.39 39.12,48.9 IOH.9
MISO  (via drill 0.48)
  Top 0.305: ZU4.16 47.38,30.49 v47.25,30.49 46.74,31 46.74,39.37 40.01,46.1 34.54,46.1 31.5,49.15 IOH.6 | v60.07,30.48 ICSP.1
  Bottom 0.305: v60.07,30.48 59.94,30.35 57.91,30.35 55.5,32.77 52.7,32.77 50.43,30.49 v47.25,30.49
MOSI  (via drill 0.48)
  Top 0.305: ZU4.15 47.62,31.37 47.62,39.62 42.35,44.9 | 42.35,44.9 40.13,47.12 36.34,47.12 34.04,49.42 IOH.7 | v54.86,44.96 54.86,43.56 56.77,41.66 61.98,41.66 62.23,41.4 62.23,37.85 63.12,36.96 63.12,33.4 64.77,31.75 64.77,28.19 65.02,27.94 ICSP.4 | v42.8,44.96 42.8,44.9 42.35,44.9
  Bottom 0.305: 54.99,44.96 v54.86,44.96 v42.8,44.96
N$1
  Top 0.305: L.A R9.1
N$2  (via drill 0.48)
  Top 0.305: FB2.1 3.24,45.78 v3.43,45.59
  Bottom 0.406: v3.43,45.59 4.32,44.7 GROUND1.1
N$3
  Top 0.305: ON.C R6.2
N$4  (via drill 0.48)
  Top 0.254: U4.P$14 15.99,35.95 16.38,35.56 17.65,35.56 19.43,33.78 v19.43,33.66 | R3.2 9.53,29.46 v9.91,29.08
  Bottom 0.305: v9.91,29.08 9.91,28.96 13.59,25.27 18.67,25.27 19.81,26.42 19.81,33.27 v19.43,33.66
N$5
  Top 0.305: RXLED.C R3.1
N$6  (via drill 0.48)
  Top 0.254: 8.57,27.37 R1.2
  Top 0.305: U4.P$7 12.84,38.98 12.7,39.12 12.7,40.13 13.34,40.77 v13.34,41.78 | 8.57,27.37 8.63,27.43 v9.91,27.43
  Bottom 0.305: v13.34,41.78 13.34,45.21 12.57,45.97 11.18,45.97 7.37,42.16 7.37,28.32 8.26,27.43 v9.91,27.43
N$7
  Top 0.305: TXLED.C R1.1
N$8
  Top 0.406: 23.88,13.59 23.88,12.45
N$9  (via drill 0.48)
  Top 0.254: v11.68,36.83 12.84,37.98 U4.P$9
  Top 0.305: R4.2 11.62,41.21 v11.94,40.89
  Bottom 0.305: v11.94,40.89 11.94,37.08 v11.68,36.83
N$10
  Top 0.254: U4.P$8 11.56,38.48
  Top 0.305: R5.2 10.1,35.63 10.67,36.2 10.67,37.59 11.56,38.48
N$11
  Top 0.254: U5.6 16.19,29.15 15.49,29.84 15.05,29.84 R16.2
  Top 0.305: R16.2 R15.1
N$13
  Top 0.305: ON/OFF.P2 5.46,17.27 JP1.1 5.46,12.32 10.16,7.62 R7.1 12.38,9.19 T2.3
N$15
  Top 0.61: D1.C 15.59,10.46 T2.2 14.4,7.74 R7.2
PWRIN
  Top 1.016: X1.PWR2 8.24,13.39 D1.A
RESET  (via drill 0.48, 0.5)
  Top 0.254: RESET-EN.1 19.56,40.95 C5.2
  Top 0.305: RESET.B' RESET.B 18.51,47.4 21.84,44.07 | ZU4.29 61.31,21.08 63.63,21.08 v63.63,20.83 64.26,21.46 64.26,24.64 ICSP.5 | v62.61,32.64 62.61,36.32 61.09,37.85 D2.A 61.21,38.61 61.21,39.5 | 61.21,39.5 R8.1 | v59.94,39.37 61.09,39.37 61.21,39.5 | POWER.3 33.02,7.11 33.66,7.75 v48.9,7.75 | 19.68,42.55 RESET-EN.1 RESET-EN.2 21.08,43.43 21.72,44.07 21.84,44.07 | v22.48,44.07 21.97,44.07 21.84,44.07
  Bottom 0.305: v59.94,39.37 60.96,40.39 60.96,45.09 59.94,46.1 22.99,46.1 22.48,45.59 v22.48,44.07 | 62.36,32.38 v62.61,32.64 62.1,32.13 62.1,26.67 61.21,25.78 61.21,21.46 61.59,21.08 63.37,21.08 v63.63,20.83 65.79,18.67 65.79,16.26 63.5,13.97 63.5,8.51 62.74,7.75 v48.9,7.75
RXD
  Top 0.254: U4.P$17 18.03,37.98 18.41,37.59 18.41,36.7 18.8,36.32 R11.2
SCK  (via drill 0.48)
  Top 0.305: 48.77,27.43 45.97,30.23 45.97,39.12 39.62,45.47 32.91,45.47 28.96,49.42 IOH.5 | 48.77,27.43 48.84,27.36 ZU4.17 | ICSP.3 v59.94,27.94 | v47.75,27.43 48.77,27.43 | R9.2 9.65,31.62 10.79,32.77 10.79,34.67 v11.68,35.56
  Bottom 0.305: 60.07,27.81 v59.94,27.94 59.82,28.07 48.39,28.07 v47.75,27.43 | v11.68,35.56 12.7,36.58 12.7,38.99 14.48,40.77 14.48,42.16 14.22,42.42 14.22,45.34 17.02,48.13 28.57,48.13 28.96,48.51 IOH.5
SS
  Top 0.305: ZU4.14 48.39,31.74 48.39,40.64 41.27,47.75 37.47,47.75 36.58,48.64 IOH.8
TXD
  Top 0.254: U4.P$1 16.49,42.21 R12.2
USBVCC  (via drill 0.48)
  Top 0.254: U4.P$12 C15.1
  Top 0.305: RXLED.A 2.51,28.32 | 2.51,28.32 TXLED.A | v3.56,28.32 2.51,28.32
  Top 0.406: C15.1 C1.1 17.85,34.48 18.29,34.04 18.29,32.77 v18.8,32.26
  Top 0.61: F2.2 11.56,43.05 v11.68,43.18 | v20.95,32.26 v18.8,32.26 | v20.95,24.51 16.76,24.51 16.76,24.49 T1.1
  Bottom 0.305: v3.56,28.32 5.46,26.42 11.43,26.42 13.34,24.51 v20.95,24.51
  Bottom 0.61: v11.68,43.18 10.16,41.66 10.16,34.29 12.95,31.5 15.75,31.5 17.02,30.23 18.29,30.23 18.8,30.73 v18.8,32.26 | v20.95,24.51 v20.95,32.26
USHIELD
  Top 0.406: FB2.2 1.78,42.34 X3.SPRT@3
  pour Bottom: 0.13,43.05 0.13,32.89 6.35,32.89 6.35,43.05
  pour Top: 0.13,43.05 0.13,32.89 6.35,32.89 6.35,43.05
VBUS
  Top 0.406: X3.VBUS 6.25,39.4 6.73,39.88 6.73,42.57 F2.1
VCCIO  (via drill 0.48)
  Top 0.305: ZU4.4 v58.19,31.73 59.02,32.56 C6.2 | FB1.1 45.09,26.04 v45.09,28.19 | v58.04,43.43 59.05,42.42 62.61,42.42 63.25,41.78 R8.2 63.63,40.01 D2.C 63.63,34.04 66.04,31.62 ICSP.2
  Top 0.406: VSELECT.2 24,12.19 v25.91,12.19
  Bottom 0.305: 55.88,35.31 55.75,35.43 48.51,35.43 45.09,32 v45.09,28.19 45.09,25.78 49.78,21.08 49.78,11.68 48.9,10.79 27.3,10.79 v25.91,12.19 | 55.88,35.31 58.19,33 v58.19,31.73 | v58.04,43.43 57.53,43.94 56.52,43.94 55.88,43.31 55.88,35.31
VIN  (via drill 0.48)
  Top 0.305: 18.1,22.55 18.1,23.56 18.29,23.75 20.57,23.75 21.72,22.61 22.35,22.61 22.67,22.61
  Top 0.406: 15.51,20.7 15.55,20.74 U1.3 | C12.1 17.91,22.55 18.1,22.55 | R13.2 22.55,22.61 22.35,22.61
  Top 0.61: 13.59,14.86 13.59,19.81 14.48,20.7 15.51,20.7 | 13.59,14.86 17.16,14.86 18.5,13.51 PC1.+ | 13.59,14.86 13.59,11.3 T2.1
  Top 0.813: v20.57,13.59 20.5,13.51 18.5,13.51 | U1.3 15.98,20.74 C12.1
  Bottom 0.813: v20.57,13.59 20.57,8.38 21.34,7.62 44.83,7.62 45.72,6.73 POWER.8
XTAL1
  Top 0.305: ZU4.7 56.08,33.02 56.64,33.02 57.46,33.84 Y2.3
XTAL2
  Top 0.305: ZU4.8 54.91,33.98 Y2.1

### Text on the board
tPlace: Reset | RST / EN | RX | TX | ON | On | DC Jack | Off | IO | 5 | v | 3
tNames: SCL | SDA | AREF | GND | # | # | # | # | # | # | DIGITAL | [#=PWM] | TX | RX | Arduino | TM | TX | RX | UNO | arduino.org | 1 | ANALOG IN | IOREF | RESET | 3V3 | 5V | GND | VIN | A0 | A1 | A2 | A3 | A4 | A5
bNames: designed by | tinker it
214bmp: D:/SmartProjects/Snc/a4_bn_logo2.bmp